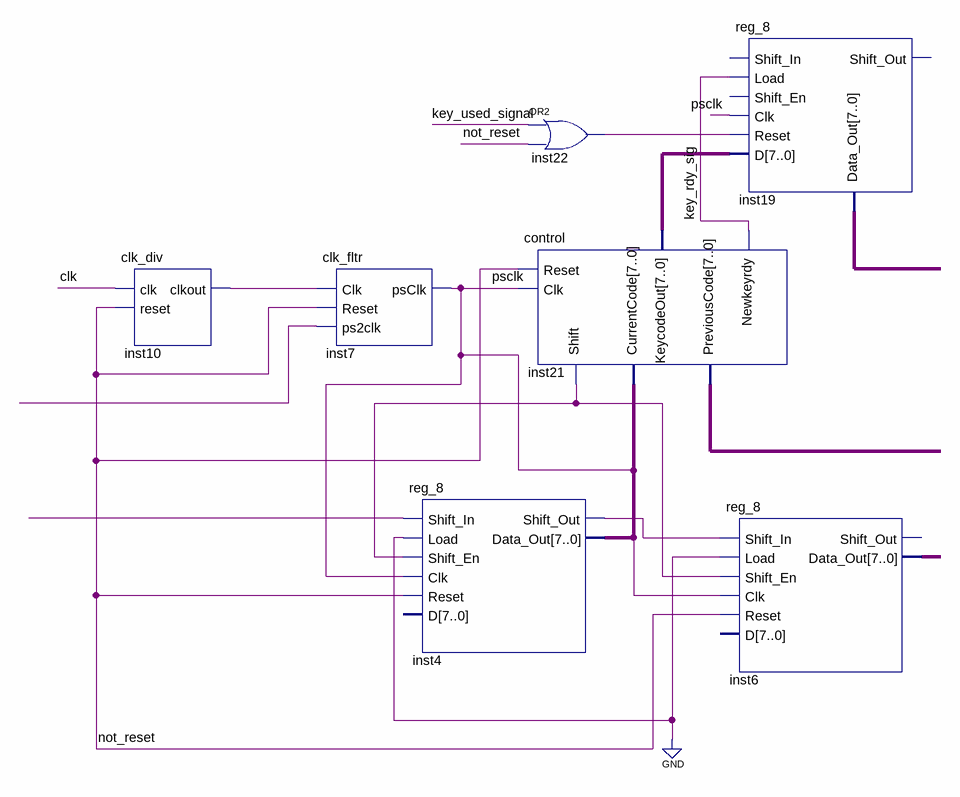
[diagram p0: schematic sheet]
// Quartus schematic mykeyboard.bdf as structural Verilog: 7 symbols, 0 pins
module mykeyboard (
);

  wire clk, inst4_shift_out, inst10_clkout, inst21_shift, inst22_out, key_rdy_sig, key_used_signal,
       not_reset, psclk, undriven, undriven_2, undriven_3;
  wire [7:0] inst4_data_out, inst6_data_out, inst19_data_out, inst21_keycodeout, undriven_4;

  clk_div inst10 (.clk(clk), .reset(not_reset), .clkout(inst10_clkout));
  clk_fltr inst7 (.Clk(inst10_clkout), .Reset(not_reset), .ps2clk(undriven), .psClk(psclk));
  reg_8 inst4 (
    .Shift_In(undriven_3), .Load(1'b0), .Shift_En(inst21_shift), .Clk(psclk), .Reset(not_reset),
    .Shift_Out(inst4_shift_out), .Data_Out(inst4_data_out));  // open: D
  or inst22 (inst22_out, key_used_signal, not_reset);
  control inst21 (
    .Reset(not_reset), .Clk(psclk), .CurrentCode(inst4_data_out), .PreviousCode(undriven_4),
    .Shift(inst21_shift), .KeycodeOut(inst21_keycodeout), .Newkeyrdy(key_rdy_sig));
  reg_8 inst19 (
    .Load(key_rdy_sig), .Clk(psclk), .Reset(inst22_out), .D(inst21_keycodeout), .Data_Out(inst19_data_out));  // open: Shift_In, Shift_En, Shift_Out
  reg_8 inst6 (
    .Shift_In(inst4_shift_out), .Load(1'b0), .Shift_En(inst21_shift), .Clk(undriven_2), .Reset(not_reset),
    .Data_Out(inst6_data_out));  // open: D, Shift_Out
endmodule
